# EAGLE design TriGUIDE_mini_v2 (EAGLE 5.05)
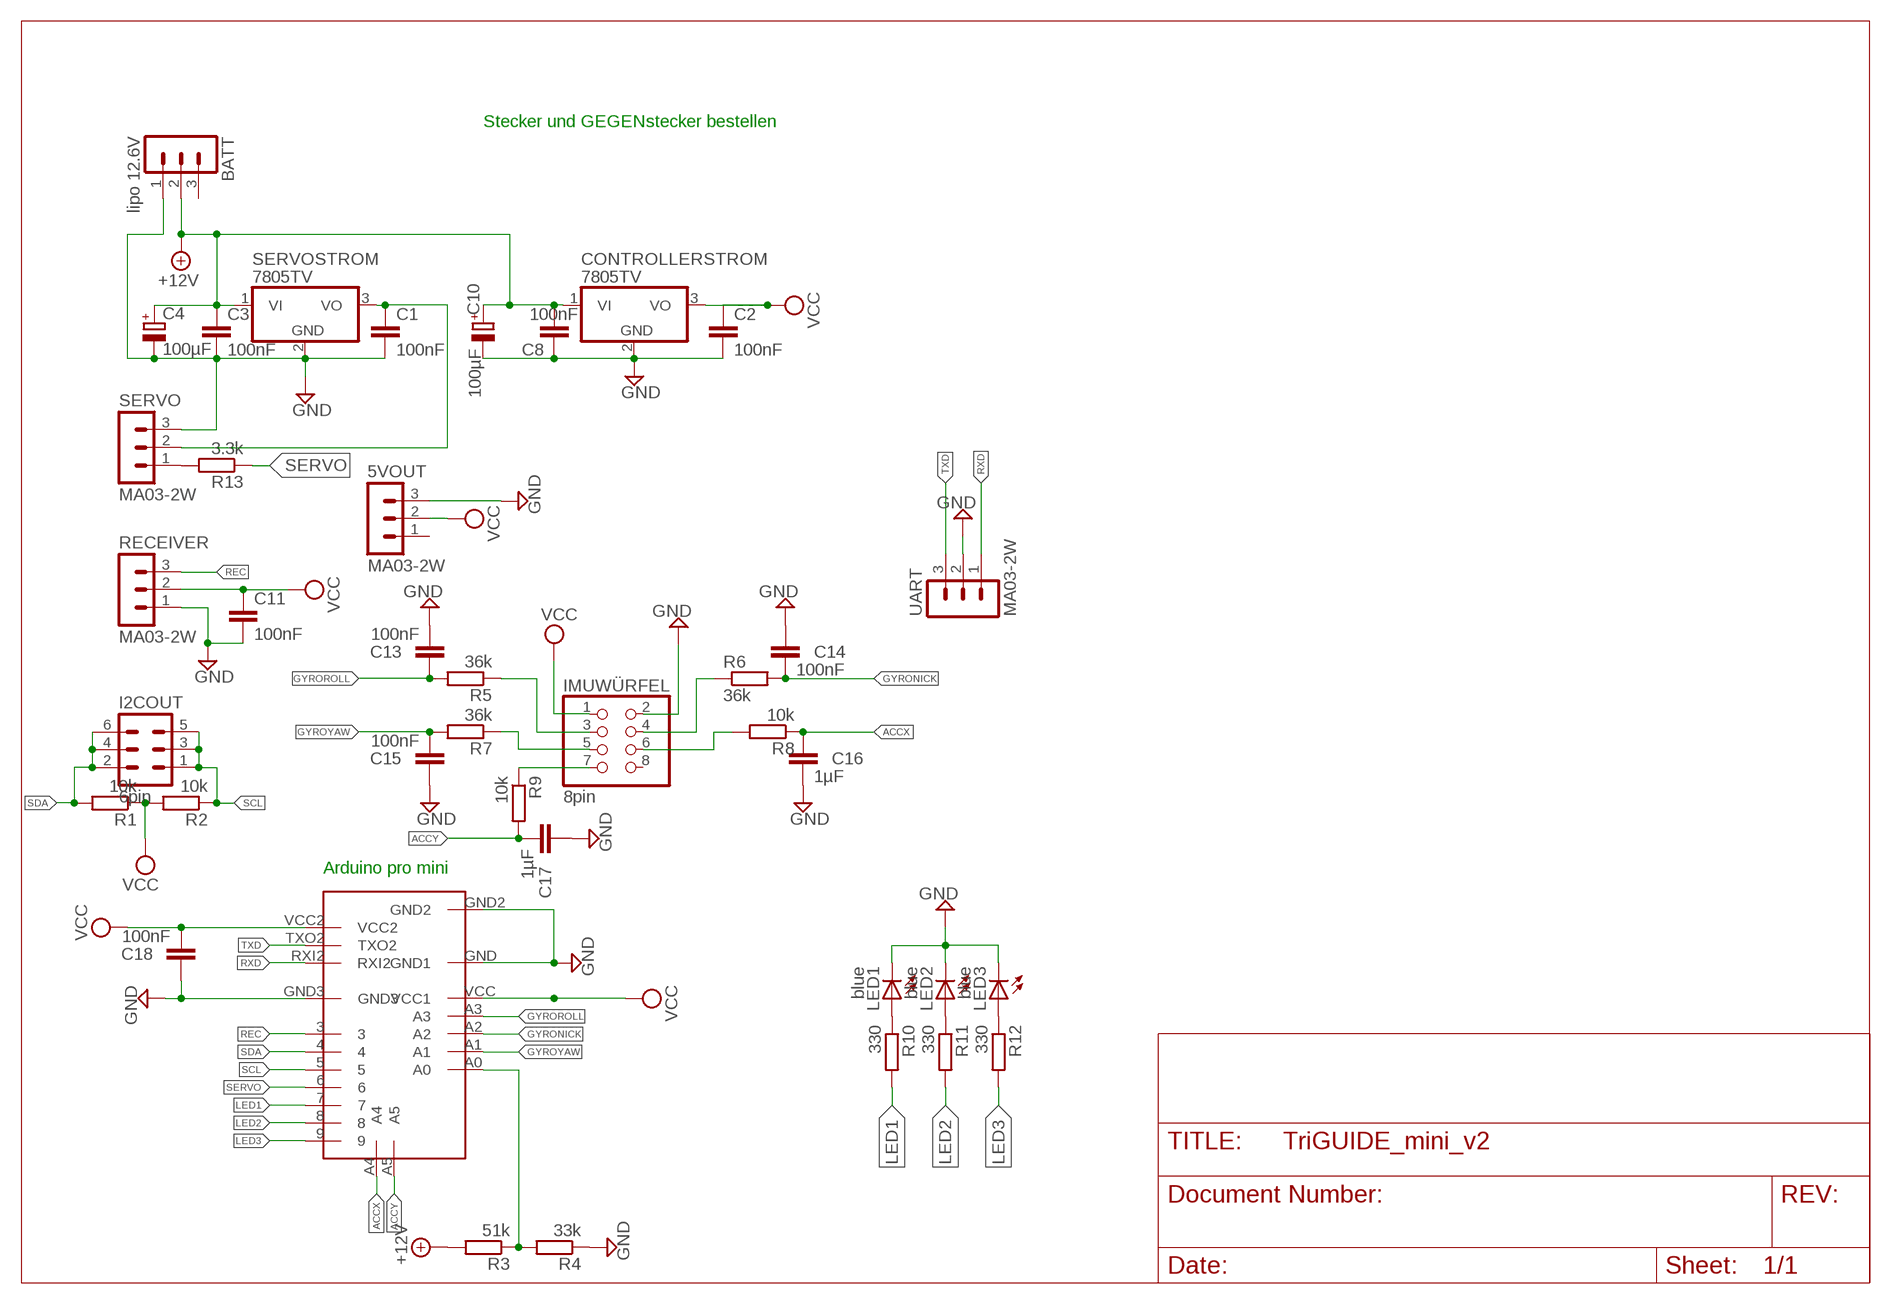
[diagram p0: schematic, sheet 1]

## Parts
5VOUT  MA03-2W  MA03-1  [MA03-1]
BATT  lipo 12.6V  MA03-1  [MA03-1]
C1  100nF  C-EUC1206  [C1206]
C2  100nF  C-EUC1206  [C1206]
C3  100nF  C-EUC1206  [C1206]
C4  100µF  CPOL-EUD/7343-31W  [D/7343-31W]
C8  100nF  C-EUC1206  [C1206]
C10  100µF  CPOL-EUD/7343-31W  [D/7343-31W]
C11  100nF  C-EUC1206  [C1206]
C13  100nF  C-EUC1206  [C1206]
C14  100nF  C-EUC1206  [C1206]
C15  100nF  C-EUC1206  [C1206]
C16  1µF  C-EUC1206  [C1206]
C17  1µF  C-EUC1206  [C1206]
C18  100nF  C-EUC1206  [C1206]
CONTROLLERSTROM  7805TV  [TO220V]
I2COUT  6pin  MA07-2W  [MA07-2W]
IMUWÜRFEL  8pin  PINHD-2X4  [2X04]
LED1  blue  LED3MM  [LED3MM]
LED2  blue  LED3MM  [LED3MM]
LED3  blue  LED3MM  [LED3MM]
R1  10k  R-EU_R1206  [R1206]
R2  10k  R-EU_R1206  [R1206]
R3  51k  R-EU_R1206  [R1206]
R4  33k  R-EU_R1206  [R1206]
R5  36k  R-EU_R1206  [R1206]
R6  36k  R-EU_R1206  [R1206]
R7  36k  R-EU_R1206  [R1206]
R8  10k  R-EU_R1206  [R1206]
R9  10k  R-EU_R1206  [R1206]
R10  330  R-EU_R1206  [R1206]
R11  330  R-EU_R1206  [R1206]
R12  330  R-EU_R1206  [R1206]
R13  3.3k  R-EU_R1206  [R1206]
RECEIVER  MA03-2W  MA03-1  [MA03-1]
SERVO  MA03-2W  MA03-1  [MA03-1]
SERVOSTROM  7805TV  [TO220V]
U$1  ARDUINOMINIPRO  [1X12]
UART  MA03-2W  MA03-1  [MA03-1]

## Nets
+12V: BATT.2 C3.1 C4.+ C8.2 C10.+ CONTROLLERSTROM.1(VI) R3.2 SERVOSTROM.1(VI)
ACCX: C16.1 R8.1 U$1.A4
ACCY: C17.2 R9.2 U$1.A5
GND: 5VOUT.3 BATT.1 C1.2 C2.2 C3.2 C4.- C8.1 C10.- C11.2 C13.2 C14.1 C15.1 C16.2 C17.1 C18.1 CONTROLLERSTROM.2(GND) IMUWÜRFEL.2 LED1.K(C) LED2.K(C) LED3.K(C) R4.1 RECEIVER.1 SERVO.3 SERVOSTROM.2(GND) U$1.GND2 U$1.GND3 U$1.GND(GND1) UART.2
GYRONICK: C14.2 R6.2 U$1.A2
GYROROLL: C13.1 R5.2 U$1.A3
GYROYAW: C15.2 R7.2 U$1.A1
LED1: R10.2 U$1.7
LED2: R11.2 U$1.8
LED3: R12.2 U$1.9
N$3: LED1.A R10.1
N$4: LED2.A R11.1
N$5: IMUWÜRFEL.3 R5.1
N$6: C1.1 SERVO.2 SERVOSTROM.3(VO)
N$7: LED3.A R12.1
N$9: R13.2 SERVO.1
N$10: R3.1 R4.2 U$1.A0
N$16: IMUWÜRFEL.4 R6.1
N$18: IMUWÜRFEL.5 R7.1
N$19: IMUWÜRFEL.6 R8.2
N$20: IMUWÜRFEL.7 R9.1
REC: RECEIVER.3 U$1.3
RXD: U$1.RXI2 UART.1
SCL: I2COUT.1 I2COUT.3 I2COUT.5 R2.1 U$1.5
SDA: I2COUT.2 I2COUT.4 I2COUT.6 R1.2 U$1.4
SERVO: R13.1 U$1.6
TXD: U$1.TXO2 UART.3
VCC: 5VOUT.2 C2.1 C11.1 C18.2 CONTROLLERSTROM.3(VO) IMUWÜRFEL.1 R1.1 R2.2 RECEIVER.2 U$1.VCC2 U$1.VCC(VCC1)
Unconnected: 5VOUT.1 BATT.3 IMUWÜRFEL.8

## Notes on the sheet
- Stecker und GEGENstecker bestellen
- Arduino pro mini

## Library data of the parts
5VOUT BATT RECEIVER SERVO UART = con-lstb:MA03-1: PIN HEADER
C1-C3 C8 C11 C13-C18 = rcl:C-EU: CAPACITOR, European symbol
C4 C10 = rcl:CPOL-EU: POLARIZED CAPACITOR, European symbol
CONTROLLERSTROM SERVOSTROM = linear:78*: Positive VOLTAGE REGULATOR Source: http://cache.national.com/ds/LM/LM78L05.pdf http://www.fairchildsemi.com/ds/LM/LM7805.pdf
I2COUT = TricopterSpecial:MA07-2W: PIN HEADER
IMUWÜRFEL = TricopterSpecial:PINHD-2X4: PIN HEADER
LED1-LED3 = Tricopter3:LED: LED OSRAM: - CHIPLED LG R971, LG N971, LY N971, LG Q971, LY Q971, LO R971, LY R971 LH N974, LH R974 LS Q976, LO Q976, LY Q976 LO Q996 - Hyper CHIPLED LW Q18S LB Q993, LB Q99A, LB R99A - SideLED LS A670, LO A670, LY A670, LG A670, LP A670 LB A673, LV A673, LT A673, LW A673 LH A674 LY A675 LS A676, LA A676, LO A676, LY A676, LW A676 LS A679, LY A679, LG A679 - Hyper Micro SIDELED® LS Y876, LA Y876, LO Y876, LY Y876 LT Y87S - SmartLED LW L88C, LW L88S LB L89C, LB L89S, LG L890 LS L89K, LO L89K, LY L89K LS L896, LA L896, LO L896, LY L896 - TOPLED LS T670, LO T670, LY T670, LG T670, LP T670 LSG T670, LSP T670, LSY T670, LOP T670, LYG T670 LG T671, LOG T671, LSG T671 LB T673, LV T673, LT T673, LW T673 LH T674 LS T676, LA T676, LO T676, LY T676, LB T676, LH T676, LSB T676, LW T676 LB T67C, LV T67C, LT T67C, LS T67K, LO T67K, LY T67K, LW E67C LS E67B, LA E67B, LO E67B, LY E67B, LB E67C, LV E67C, LT E67C LW T67C LS T679, LY T679, LG T679 LS T770, LO T770, LY T770, LG T770, LP T770 LB T773, LV T773, LT T773, LW T773 LH T774 LS E675, LA E675, LY E675, LS T675 LS T776, LA T776, LO T776, LY T776, LB T776 LHGB T686 LT T68C, LB T68C - Hyper Mini TOPLED® LB M676 - Mini TOPLED Santana® LG M470 LS M47K, LO M47K, LY M47K Source: http://www.osram.convergy.de LUXEON: - LUMILED® LXK2-PW12-R00, LXK2-PW12-S00, LXK2-PW14-U00, LXK2-PW14-V00 LXK2-PM12-R00, LXK2-PM12-S00, LXK2-PM14-U00 LXK2-PE12-Q00, LXK2-PE12-R00, LXK2-PE12-S00, LXK2-PE14-T00, LXK2-PE14-U00 LXK2-PB12-K00, LXK2-PB12-L00, LXK2-PB12-M00, LXK2-PB14-N00, LXK2-PB14-P00, LXK2-PB14-Q00 LXK2-PR12-L00, LXK2-PR12-M00, LXK2-PR14-Q00, LXK2-PR14-R00 LXK2-PD12-Q00, LXK2-PD12-R00, LXK2-PD12-S00 LXK2-PH12-R00, LXK2-PH12-S00 LXK2-PL12-P00, LXK2-PL12-Q00, LXK2-PL12-R00 Source: www.luxeon.com KINGBRIGHT: KA-3528ASYC Source: www.kingbright.com
R1-R13 = resistor:R-EU_: RESISTOR, European symbol
U$1 = TricopterSpecial2:ARDUINOMINIPRO

## Board
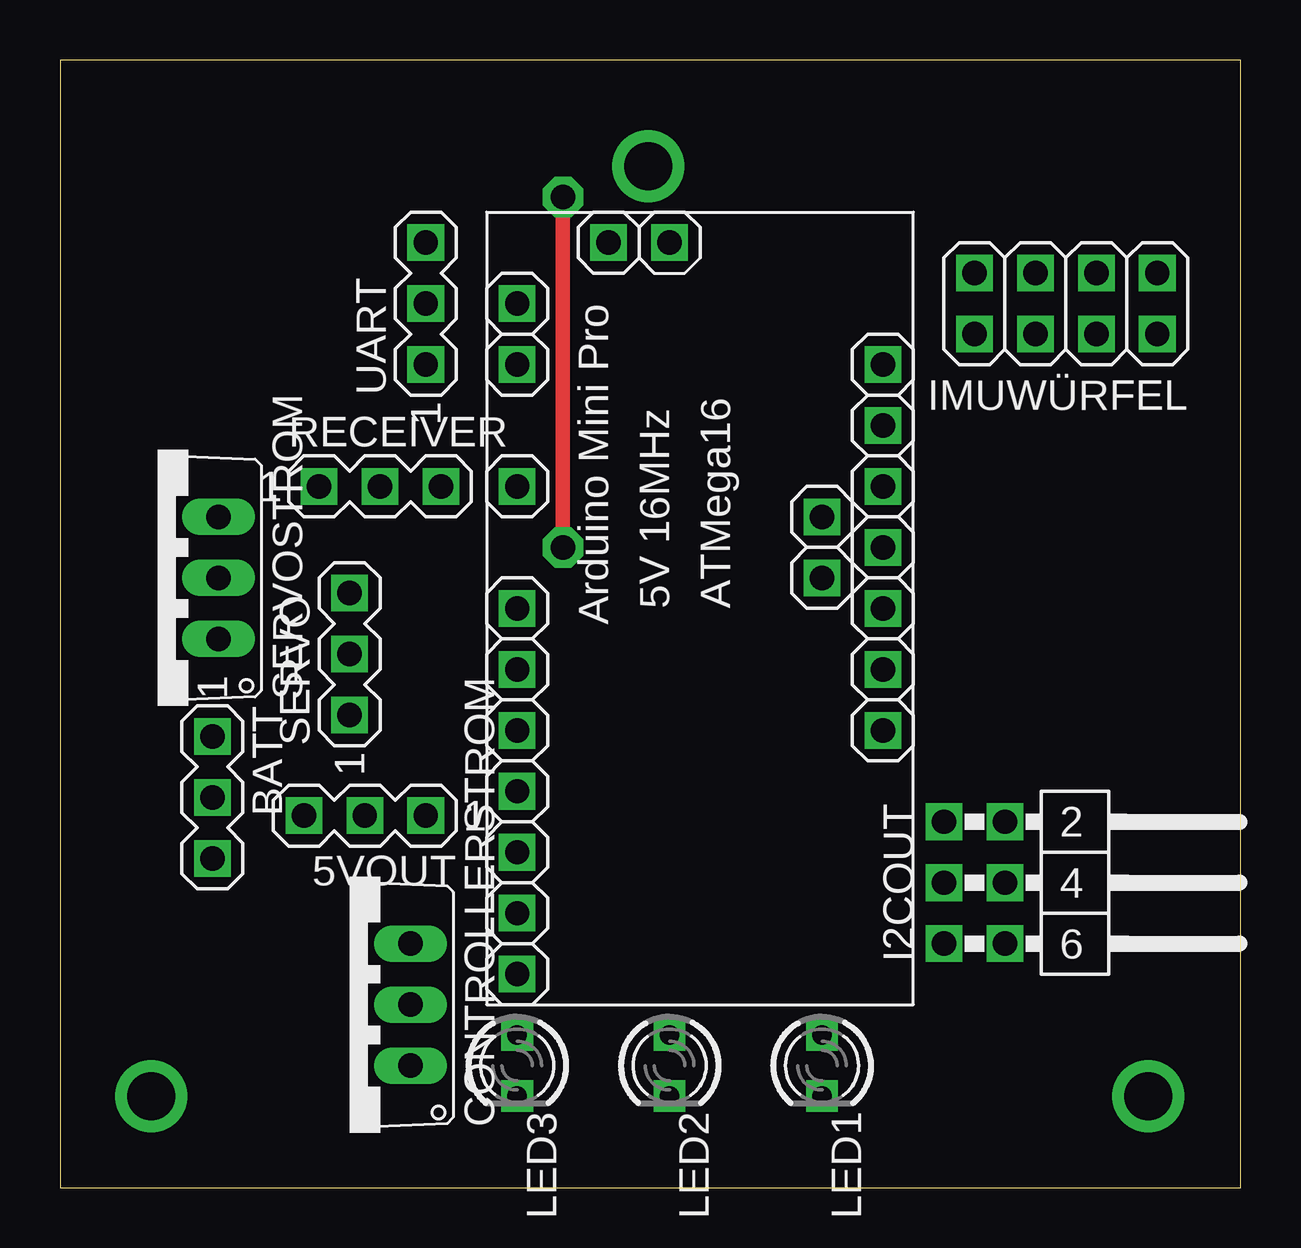
[diagram p1: board, top side]
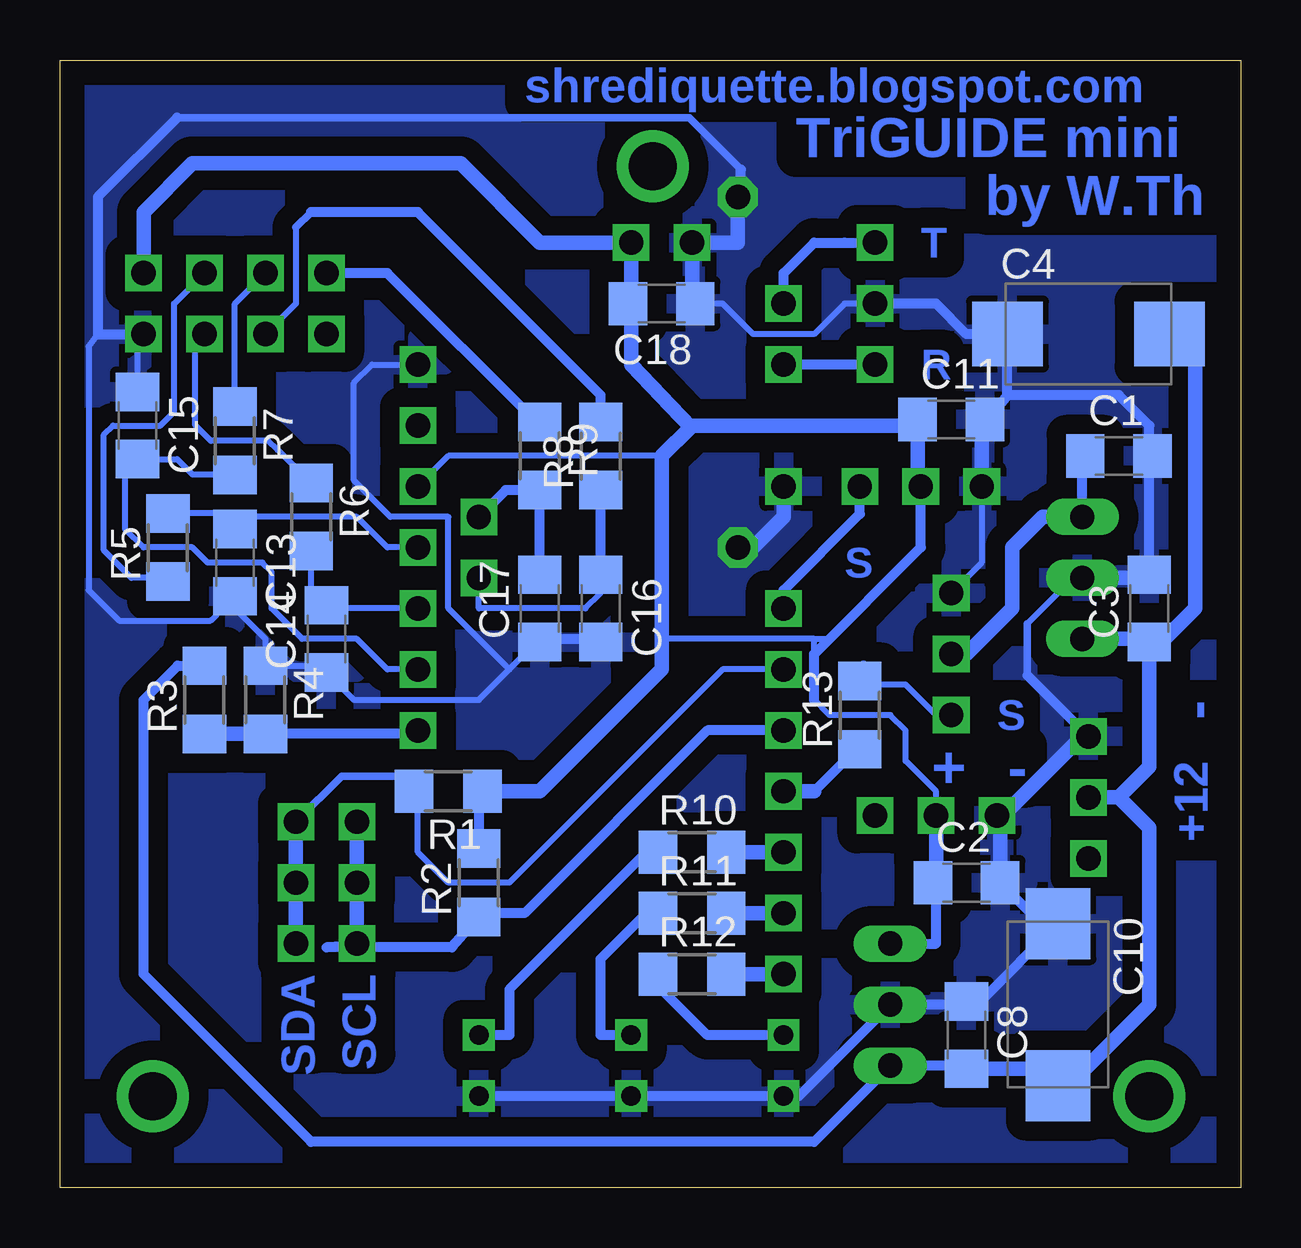
[diagram p2: board, bottom side, seen from below]

Size 49.2 x 46.98 mm. Coordinates in mm from the lower left corner, seen from the top.
Outline: 0,0 49.2,0 49.2,46.98 0,46.98 0,0
Copper layers (1*16): Top 0.035mm / dielectric 1.5mm / Bottom 0.035mm
Design rules "Bilex DRU": minimum track width 10mil, minimum drill 24mil, track to track 10mil, track to pad 10mil, pad to pad 10mil, via to via 10mil, smd to smd 10mil, copper to edge 40mil, drill to drill 8mil, minimum pad ring 10mil, minimum via ring 8mil, stop-mask expansion 4mil, vias tented up to drill 0mil, thermal gap 10mil

### Footprints (pad centres in the part's own frame; a part is rotated, then mirrored left to right if it is on the bottom)
MA03-1 = drill 1.016 pad 1.524 square: 1 -2.54,0 | drill 1.016 square: 2 0,0; 3 2.54,0
C1206 = smd 1.6 x 1.8: 1 -1.4,0; 2 1.4,0
D/7343-31W = smd 2.95 x 2.7: + 3.375,0; - -3.375,0
TO220V = drill 1.016 long: 1 -2.54,-2.54; 2 0,-2.54; 3 2.54,-2.54
MA07-2W = drill 1.016 square: 1 -2.54,-2.54; 3 0,-2.54; 4 0,0; 5 2.54,-2.54; 6 2.54,0 | drill 1.016 pad 1.524 square: 2 -2.54,0
2X04 = drill 1.016 square: 1 -3.81,-1.27; 3 -1.27,-1.27; 4 -1.27,1.27; 5 1.27,-1.27; 6 1.27,1.27; 7 3.81,-1.27; 8 3.81,1.27 | drill 1.016 pad 1.524 square: 2 -3.81,1.27
LED3MM = drill 0.813 square: A -1.27,0; K 1.27,0
R1206 = smd 1.6 x 1.803: 1 -1.422,0; 2 1.422,0
1X12 = drill 1.016 square: 3 0,15.24; 4 0,12.7; 5 0,10.16; 6 0,7.62; A0 15.24,10.16; A1 15.24,12.7; A2 15.24,15.24; A3 15.24,17.78; A4 12.7,16.51; GND 15.24,25.4; GND2 3.81,30.48; GND3 0,20.32; RST 15.24,22.86; RXI2 0,25.4; TXO2 0,27.94; VCC 15.24,20.32; VCC2 6.35,30.48 | drill 1.016 pad 1.524 square: 7 0,5.08; 8 0,2.54; 9 0,0; A5 12.7,19.05

### Placement (x,y rotation side)
5VOUT  12.7,15.49 180 top
BATT  6.35,16.26 270 top
C1  5.08,30.48 0 bottom
C2  11.43,12.7 0 bottom
C3  3.81,24.13 90 bottom
C4  6.35,35.56 0 bottom
C8  11.43,6.35 270 bottom
C10  7.62,7.62 270 bottom
C11  12.06,32 0 bottom
C13  41.91,26.04 270 bottom
C14  38.1,22.86 90 bottom
C15  45.97,31.75 270 bottom
C16  26.67,24.13 270 bottom
C17  29.21,24.13 90 bottom
C18  24.13,36.83 180 bottom
CONTROLLERSTROM  12.06,7.62 90 top
I2COUT  39.37,12.7 270 top
IMUWÜRFEL  41.91,36.83 180 top
LED1  31.75,5.08 270 top
LED2  25.4,5.08 270 top
LED3  19.05,5.08 270 top
R1  33.02,16.51 180 bottom
R2  31.75,12.7 90 bottom
R3  43.18,20.32 90 bottom
R4  40.64,20.32 270 bottom
R5  44.7,26.67 90 bottom
R6  38.73,27.94 270 bottom
R7  41.91,31.11 270 bottom
R8  26.67,30.48 90 bottom
R9  29.21,30.48 270 bottom
R10  22.86,13.97 0 bottom
R11  22.86,11.43 0 bottom
R12  22.86,8.89 0 bottom
R13  15.88,19.68 90 bottom
RECEIVER  13.34,29.21 0 top
SERVO  12.06,22.23 90 top
SERVOSTROM  4.06,25.4 90 top
U$1  19.05,8.89 0 top
UART  15.24,36.83 90 top

### Tracks (layer width: path | path; a pad name or v marks a point on that pad's centre or on a via)
+12V
  Bottom 0.254: C8.2 11.56,5.08 | 8.32,4.95 C10.+ 7.62,3.81 | 3.94,22.86 C3.1 3.68,22.86 3.17,22.86
  Bottom 0.406: R3.2 44.3,21.74 45.72,20.32 45.72,8.89 38.73,1.91 17.78,1.91 CONTROLLERSTROM.1 11.56,5.08
  Bottom 0.61: 8.32,4.95 C8.2 | 5.08,16.26 BATT.2 | 5.08,16.26 3.81,14.99 3.81,7.62 7.62,3.81 | 5.08,16.26 3.81,17.53 C3.1 | 3.94,22.86 SERVOSTROM.1 | 3.17,22.86 1.91,24.13 1.91,34.49 C4.+
ACCX
  Bottom 0.254: C16.1 26.67,24.77 27.3,24.13 31.75,24.13 U$1.A4
  Bottom 0.406: C16.1 R8.1
ACCY
  Bottom 0.406: C17.2 R9.2 30.63,29.06 U$1.A5
GND  (via drill 1.02 pad 1.68)
  Top 0.61: v20.95,41.27 v20.95,26.67
  Bottom 0.254: C18.1 22.86,36.96 | 26.67,22.86 C16.2 | 30.48,21.59 31.75,20.32 36.96,20.32 C14.1 38.38,21.74 R4.1 40.64,22.86 41.91,24.13 | 30.48,21.59 29.21,22.86 C17.1 | 47.62,35.56 48.01,35.05 48.01,24.89 46.74,23.62 42.93,23.62 42.42,24.13 41.91,24.13 | 41.91,24.13 C13.2 | U$1.GND 36.2,34.29 36.96,33.53 36.96,29.46 35.43,27.94 33.02,27.94 33.02,24.13 30.48,21.59 | C11.2 10.79,31.75 | C18.1 21.59,36.83 20.32,35.56 17.78,35.56 16.51,36.83 UART.2 | C18.1 22.86,36.83 | 11.56,7.62 C8.1 10.87,7.75 | C10.- 8.32,10.99 | 10.03,15.11 5VOUT.3 | 3.38,25.4 3.81,25.4 C3.2 3.94,25.4 SERVOSTROM.2 6.99,25.4 8.89,23.5 | 3.81,30.61 C1.2 3.81,30.48 | SERVO.3 10.79,26.04 RECEIVER.1 | C15.1 45.97,35.31 IMUWÜRFEL.2
  Bottom 0.305: 8.89,21.34 8.89,23.5 | 20.83,42.42 22.99,44.58 44.32,44.58
  Bottom 0.406: 29.21,22.86 26.67,22.86 | LED1.K LED2.K LED3.K 18.41,3.81 CONTROLLERSTROM.2 11.56,7.62 | IMUWÜRFEL.2 47.62,35.56 47.62,41.27 44.32,44.58 | C10.- 10.87,7.75 | 8.32,10.99 C2.2 | BATT.1 8.89,21.34 | 3.81,30.61 3.81,31.75 5.08,33.02 9.72,33.02 | C3.2 3.81,30.48 | UART.2 12.7,36.83 11.43,35.56 C4.- 9.72,33.02 | v20.95,41.27 20.83,41.4 20.83,42.42 | 9.72,33.02 10.99,31.42 C11.2
  Bottom 0.61: 22.86,36.96 U$1.GND2 20.95,39.37 v20.95,41.27 | 10.79,31.75 RECEIVER.1 | C2.2 10.03,15.11 | BATT.1 6.6,18.8 10.16,15.24 5VOUT.3 | SERVOSTROM.2 3.81,25.4 | U$1.GND3 19.05,27.94 20.32,26.67 v20.95,26.67
  pour Bottom (isolate 0.813): 0,0 0,46.99 49.03,46.99 49.13,0
GYRONICK
  Bottom 0.254: U$1.A2 38.1,24.13 C14.2 38.73,24.89 R6.2
GYROROLL
  Bottom 0.254: U$1.A3 35.56,26.67 36.83,27.94 41.41,27.94 C13.1 42.57,28.09 R5.2
GYROYAW
  Bottom 0.254: U$1.A1 35.56,21.59 36.83,22.86 39.12,22.86 40.39,24.13 40.39,25.65 40.77,26.04 43.05,26.04 43.69,26.67 45.72,26.67 46.48,27.43 46.48,30.23 45.84,30.23 C15.2 44.32,30.35 43.69,29.72 41.94,29.72 R7.2
LED1
  Bottom 0.61: U$1.7 R10.2
LED2
  Bottom 0.61: U$1.8 R11.2
LED3
  Bottom 0.61: U$1.9 R12.2
N$1  (via drill 2 pad 2.18)
  other vias: 24.51,42.55
N$2  (via drill 2)
  other vias: 3.81,3.81
N$3
  Bottom 0.254: R10.1 24.92,13.82
  Bottom 0.406: LED1.A 30.48,6.35 30.48,8.26 24.92,13.82
N$4
  Bottom 0.254: 24.77,11.43 R11.1
  Bottom 0.406: 24.77,11.43 26.67,9.53 26.67,6.35 LED2.A
N$5
  Bottom 0.254: IMUWÜRFEL.3 44.45,36.83 44.45,32.32 45.02,31.75 46.99,31.75 47.37,31.37 47.37,26.54 46.23,25.4 44.6,25.4 R5.1
N$6
  Bottom 0.254: 6.6,30.35 C1.1 | SERVO.2 11.43,22.23
  Bottom 0.406: SERVOSTROM.3 6.6,30.35
  Bottom 0.61: 11.43,22.23 9.53,24.13 9.53,26.67 8.26,27.94 SERVOSTROM.3
N$7
  Bottom 0.254: 24.77,8.89 R12.1
  Bottom 0.406: 24.77,8.89 22.23,6.35 LED3.A
N$8  (via drill 2)
  other vias: 45.34,3.81
N$9
  Bottom 0.254: R13.2 15.72,20.95 13.97,20.95 12.7,19.68 SERVO.1
  Bottom 0.406: R13.2 15.72,21.74
N$10
  Bottom 0.254: U$1.A0 34.44,18.9
  Bottom 0.406: 34.44,18.9 R4.2
  Bottom 0.61: R4.2 R3.1
N$16
  Bottom 0.254: IMUWÜRFEL.4 43.18,34.92 43.56,35.05 43.56,31.76 42.92,31.11 40.51,31.11 40.13,30.73 38.86,29.49 R6.1
N$18
  Bottom 0.254: R7.1 41.91,36.83 IMUWÜRFEL.5
N$19
  Bottom 0.254: 39.37,40.01 39.37,36.83 IMUWÜRFEL.6
  Bottom 0.305: 38.73,40.64 39.37,40.01
  Bottom 0.406: R8.2 26.67,33.02 34.29,40.64 38.73,40.64
N$20
  Bottom 0.254: R9.1 29.36,31.9
  Bottom 0.406: 29.36,31.9 35.56,38.1 IMUWÜRFEL.7
REC
  Bottom 0.406: RECEIVER.3 15.88,28.07 19.05,24.89 U$1.3
RXD
  Bottom 0.406: UART.1 U$1.RXI2
SCL
  Bottom 0.254: 31.75,11.43 31.6,11.43 R2.1
  Bottom 0.406: U$1.5 22.23,19.05 29.84,11.43 31.6,11.43 | R2.1 32.87,10.01 38.1,10.01 I2COUT.5
  Bottom 0.61: I2COUT.5 I2COUT.3 I2COUT.1
SDA
  Bottom 0.254: U$1.4 21.59,21.59 30.48,12.7 33.02,12.7 34.29,13.97 34.29,16.36 R1.2 34.44,16.66 34.92,17.14
  Bottom 0.305: 34.92,17.14 37.47,17.14 I2COUT.2
  Bottom 0.61: I2COUT.2 I2COUT.4 I2COUT.6
SERVO
  Bottom 0.406: R13.1 16.03,18.26 17.78,16.51
  Bottom 0.61: 17.78,16.51 U$1.6
TXD
  Bottom 0.406: UART.3 16.51,39.37 17.78,39.37 19.05,38.1 U$1.TXO2
VCC
  Bottom 0.254: C18.2 25.4,36.96 | RECEIVER.2 13.46,29.34 | 5VOUT.2 12.7,16.51 13.97,17.78 13.97,19.05 14.61,19.68 17.14,19.68 17.78,20.32 | 12.7,12.83 C2.1 12.7,12.57 | 24.13,30.48 33.02,30.48 U$1.VCC | 17.78,22.23 17.78,22.86 | 17.78,22.86 17.14,22.86 | 17.78,22.86 24.13,22.86
  Bottom 0.406: 31.75,16.36 R2.2 | CONTROLLERSTROM.3 12.7,10.16 12.7,12.57 | 25.4,36.96 25.53,36.96 | 22.93,31.68 22.86,31.75 | 17.78,20.32 17.78,22.23 13.34,26.67 RECEIVER.2 | 25.4,36.83 C18.2
  Bottom 0.61: 31.75,16.36 R1.1 29.21,16.51 24.13,21.59 24.13,22.86 24.13,30.48 22.93,31.68 25.4,34.29 25.4,36.83 U$1.VCC2 29.21,39.37 32.51,42.67 43.69,42.67 45.72,40.64 IMUWÜRFEL.1 | 13.46,29.34 C11.1 | 12.7,12.83 5VOUT.2 | 22.86,31.75 13.72,31.75 C11.1

### Text on the board
Bottom: shrediquette.blogspot.com | TriGUIDE mini | by W.Th | T | R | S | - | S | +12 | - | + | SCL | SDA